# Altium project BeagleBone_Card.PrjPcb (part 1 of 4)
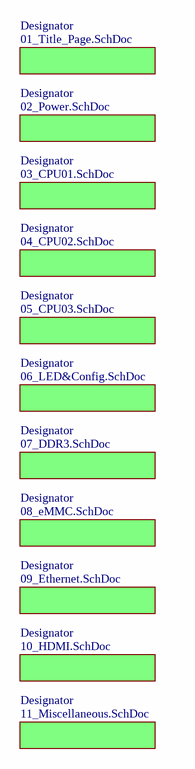
[diagram p0: BeagleBone_Card.SchDoc]
12 sheets, 376 parts. Net scope: flat (ports and power ports of the same name join across sheets).
Board file: BeagleBone_Card.PcbDoc
Sheets:
  BeagleBone_Card.SchDoc
    Designator = 02_Power.SchDoc
    Designator = 03_CPU01.SchDoc
    Designator = 04_CPU02.SchDoc
    Designator = 05_CPU03.SchDoc
    Designator = 06_LED&Config.SchDoc
    Designator = 07_DDR3.SchDoc
    Designator = 08_eMMC.SchDoc
    Designator = 09_Ethernet.SchDoc
    Designator = 10_HDMI.SchDoc
    Designator = 11_Miscellaneous.SchDoc
    Designator = 01_Title_Page.SchDoc

## Sheet BeagleBone_Card.SchDoc
size A4; Engineer: Mehmet Selcuk Yayan; Organization: Procenne

### Sub-sheets
Designator = 02_Power.SchDoc: no entries
Designator = 03_CPU01.SchDoc: no entries
Designator = 04_CPU02.SchDoc: no entries
Designator = 05_CPU03.SchDoc: no entries
Designator = 06_LED&Config.SchDoc: no entries
Designator = 07_DDR3.SchDoc: no entries
Designator = 08_eMMC.SchDoc: no entries
Designator = 09_Ethernet.SchDoc: no entries
Designator = 10_HDMI.SchDoc: no entries
Designator = 11_Miscellaneous.SchDoc: no entries
Designator = 01_Title_Page.SchDoc: no entries

### Notes on the sheet
- © 2020 Procenne Systems
- Title:
- Size:
- A4
- Number:
- Date:
- Rev:
- Sheet
- of

## Sheet 02_Power.SchDoc
size A4; Engineer: Mehmet Selcuk Yayan; Organization: Procenne
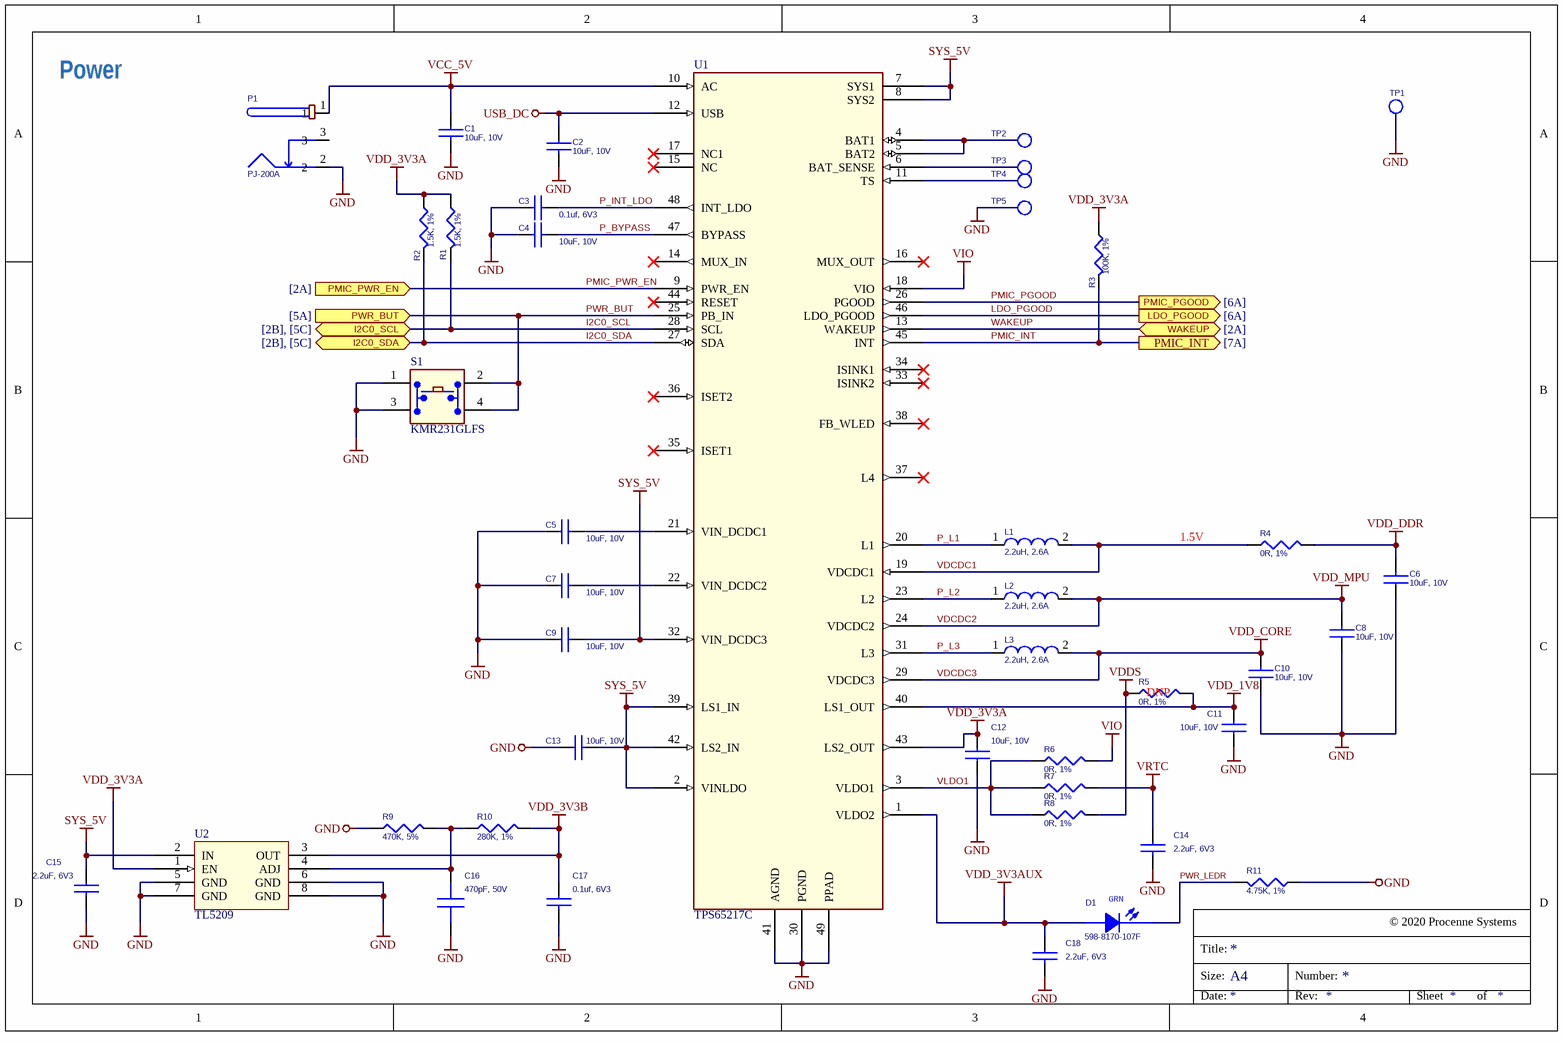
[diagram p1: 02_Power.SchDoc]

### Parts
C1  10uF, 10V  [805]
C2  10uF, 10V  [805]
C3  0.1uf, 6V3  [402]
C4  10uF, 10V  [805]
C5  10uF, 10V  [805]
C6  10uF, 10V  [805]
C7  10uF, 10V  [805]
C8  10uF, 10V  [805]
C9  10uF, 10V  [805]
C10  10uF, 10V  [805]
C11  10uF, 10V  [805]
C12  10uF, 10V  [805]
C13  10uF, 10V  [805]
C14  2.2uF, 6V3  [402]
C15  2.2uF, 6V3  [402]
C16  470pF, 50V  [402]
C17  0.1uf, 6V3  [402]
C18  2.2uF, 6V3  [402]
D1  598-8170-107F  [LED_0603]
L1  2.2uH, 2.6A  [2520]
L2  2.2uH, 2.6A  [2520]
L3  2.2uH, 2.6A  [2520]
P1  PJ-200A  [CONN3-PWR-PJ102A]
R1  1.5K, 1%  [402]
R2  1.5K, 1%  [402]
R3  100K, 1%  [402]
R4  0R, 1%  [402]
R5  0R, 1%  [402]
R6  0R, 1%  [402]
R7  0R, 1%  [402]
R8  0R, 1%  [402]
R9  470K, 5%  [402]
R10  280K, 1%  [402]
R11  4.75K, 1%  [402]
S1  KMR231GLFS  [SW4SMD_63X161LS]
TP1  TESTPT1  [tp1-8040]  (value not drawn)  (no BOM)
TP2  TESTPT1  [tp1-8040]  (value not drawn)  (no BOM)
TP3  TESTPT1  [tp1-8040]  (value not drawn)  (no BOM)
TP4  TESTPT1  [tp1-8040]  (value not drawn)  (no BOM)
TP5  TESTPT1  [tp1-8040]  (value not drawn)  (no BOM)
U1  TPS65217C  [U_48_RSL]
U2  TL5209  [SO8-25X75]

### Ports
I2C0_SCL (bidir, see [2B], [5C]), I2C0_SDA (bidir, see [2B], [5C]), LDO_PGOOD (out, see [6A]), PMIC_INT (out, see [7A]), PMIC_PGOOD (out, see [6A]), PMIC_PWR_EN (in, see [2A]), PWR_BUT (in, see [5A]), WAKEUP (bidir, see [2A])

### Nets
GND: C1.2 C2.2 C3.1 C4.1 C5.1 C6.1 C7.1 C8.1 C9.1 C10.1 C11.1 C12.1 C13.1 C14.2 C15.2 C16.2 C17.2 C18.2 P1.2 R9.1 R11.1 S1.1(A1) S1.3(A3) TP1.1(TP) TP5.1(TP) U1.30(PGND) U1.41(AGND) U1.49(PPAD) U2.5(GND) U2.6(GND) U2.7(GND) U2.8(GND)
SYS_5V: C9.2 C13.2 C15.1 U1.2(VINLDO) U1.7(SYS1) U1.8(SYS2) U1.32(VIN_DCDC3) U1.39(LS1_IN) U1.42(LS2_IN) U2.2(IN)
USB_DC: C2.1 U1.12(USB)
VCC_5V: C1.1 P1.1 U1.10(AC)
VDCDC2: C8.2 L2.2 U1.24(VDCDC2)  [also labelled VDD_MPU]
VDCDC3: C10.2 L3.2 U1.29(VDCDC3)  [also labelled VDD_CORE]
VDD_1V8: C11.2 R5.1(P1) U1.40(LS1_OUT)
VDD_3V3A: C12.2 R1.1 R2.1 R3.1 U1.43(LS2_OUT) U2.1(EN)
VDD_3V3AUX: C18.1 D1.2(A) U1.1(VLDO2)
VDD_3V3B: C17.1 R10.2 U2.3(OUT)
VDD_DDR: C6.2 R4.1(P1)
VDDS: R5.2(P2) R8.1(P1)
VIO: R6.1(P1) U1.18(VIO)
VRTC: C14.1 R7.1(P1)
I2C0_SCL: R1.2 U1.28(SCL) ; port I2C0_SCL
I2C0_SDA: R2.2 U1.27(SDA) ; port I2C0_SDA
LDO_PGOOD: U1.46(LDO_PGOOD) ; port LDO_PGOOD
P_BYPASS: C4.2 U1.47(BYPASS)
P_INT_LDO: C3.2 U1.48(INT_LDO)
P_L1: L1.1 U1.20(L1)
P_L2: L2.1 U1.23(L2)
P_L3: L3.1 U1.31(L3)
PMIC_INT: R3.2 U1.45(INT) ; port PMIC_INT
PMIC_PGOOD: U1.26(PGOOD) ; port PMIC_PGOOD
PMIC_PWR_EN: U1.9(PWR_EN) U1.13(WAKEUP) ; port PMIC_PWR_EN, port WAKEUP  [also labelled WAKEUP]  [project net PMIC_POWR_EN]
PWR_BUT: S1.2(A2) S1.4 U1.25(PB_IN) ; port PWR_BUT
PWR_LEDR: D1.1(C) R11.2
VDCDC1: L1.2 R4.2(P2) U1.19(VDCDC1)
VLDO1: R6.2(P2) R7.2(P2) R8.2(P2) U1.3(VLDO1)
NetC5_2: C5.2 U1.21(VIN_DCDC1)
NetC7_2: C7.2 U1.22(VIN_DCDC2)
NetC16_1: C16.1 R9.2 R10.1 U2.4(ADJ)
NetTP2_1: TP2.1(TP) U1.4(BAT1) U1.5(BAT2)
NetTP3_1: TP3.1(TP) U1.6(BAT_SENSE)
NetTP4_1: TP4.1(TP) U1.11(TS)

Not connected (* = marked no-connect by the designer): P1 3; U1 14(MUX_IN)* 15(NC)* 16(MUX_OUT)* 17(NC1)* 33(ISINK2)* 34(ISINK1)* 35(ISET1)* 36(ISET2)* 37(L4)* 38(FB_WLED)* 44(RESET)*

### Notes on the sheet
- Power
- 1.5V
- (near R5) DNP
- © 2020 Procenne Systems
- Title:
- Size:
- A4
- Number:
- Date:
- Rev:
- Sheet
- of
- (in symbol LED_LTST-C150GKT) GRN

### Library data of the parts
C1 C2 C4-C13 = CAP_10uF_Y5V_10V_10%_0805: CAP CER 10UF 10V Y5V 0805; Manufacturer: TDK Corporation; Manufacturer Part Number: C2012Y5V1A106Z; Capacitance: 10µF; Tolerance: -20%, +80%; Temperature Coefficient: Y5V (F); Supplier 1: Digi-Key; Supplier Part Number 1: 445-1371-6-ND; RoHS: RoHS Compliant; Category: Capacitors; Stock 1: 123307; Pricing 1: 1=0.15, 10=0.105, 100=0.0499, 250=0.042, 500=0.03518, 1000=0.02887 (USD); Voltage - Rated: 10V; Mounting Type: Surface Mount, MLCC; Operating Temperature: -30°C ~ 85°C; Applications: General Purpose; Ratings: -; Package / Case: 0805 (2012 Metric); Size / Dimension: 0.079" L x 0.049" W (2.00mm x 1.25mm); Height - Seated (Max): -; Thickness (Max): 0.057" (1.45mm); Lead Spacing: -; Features: -; Packaging: Digi-Reel®; Lead Style: -; ComponentLink1URL: http://media.digikey.com/pdf/Data%20Sheets/TDK%20PDFs/C_Series_GeneralAppl_B11.pdf; ComponentLink1Description: http://media.digikey.com/pdf/Data%20Sheets/TDK%20PDFs/C_Series_GeneralAppl_B11.pdf
C3 C17 = CAP_0.1uF_X7R_16V_10% 0402: CAP CER 0.1UF 6.3V 10% X5R 0402; Manufacturer: TDK Corporation; Manufacturer Part Number: C1005X5R0J104K050BA; Capacitance: 0.1µF; Applications: General Purpose; Category: Capacitors; ComponentLink1Description: http://www.kemet.com/datasheets&C0402C104K4RACTU; ComponentLink1URL: http://www.kemet.com/datasheets&C0402C104K4RACTU; Features: -; Height - Seated (Max): -; Lead Spacing: -; Lead Style: -; Mounting Type: Surface Mount, MLCC; Operating Temperature: -55°C ~ 85°C; Package / Case: 0402 (1005 Metric); Packaging: Digi-Reel®; Pricing 1: 1=0.1, 10=0.026, 100=0.0121, 250=0.00992, 500=0.00848, 1000=0.0066, 5000=0.0055 (USD); Ratings: -; RoHS: RoHS Compliant; Size / Dimension: 0.039" L x 0.020" W (1.00mm x 0.50mm); Stock 1: 127604; Supplier 1: Digi-Key; Supplier Part Number 1: 445-1266-6-ND; Temperature Coefficient: X5R; Thickness (Max): 0.022" (0.55mm); Tolerance: ±10%; Voltage - Rated: 6.3V
C14 C15 C18 = CAP_2.2uF_X5R_6.3V_10%_0402: CAP CER 2.2UF 6.3V 10% X5R 0402; Manufacturer: TDK Corporation; Manufacturer Part Number: C1005X5R0J225K050BC; Capacitance: 2.2µF; Supplier 1: Digi-Key; Supplier Part Number 1: 445-6847-6-ND; RoHS: RoHS Compliant; Category: Capacitors; Stock 1: 47221; Pricing 1: 1=0.24, 10=0.2, 100=0.1, 250=0.075, 500=0.06626, 1000=0.05875, 5000=0.04875 (USD); Voltage - Rated: 6.3V; Tolerance: ±10%; Temperature Coefficient: X5R; Mounting Type: Surface Mount, MLCC; Operating Temperature: -55°C ~ 85°C; Applications: General Purpose; Ratings: -; Package / Case: 0402 (1005 Metric); Size / Dimension: 0.039" L x 0.020" W (1.00mm x 0.50mm); Height - Seated (Max): -; Thickness (Max): 0.022" (0.55mm); Lead Spacing: -; Features: -; Packaging: Digi-Reel®; Lead Style: -; ComponentLink1URL: http://product.tdk.com/capacitor/mlcc/en/documents/mlcc_commercial_general_en.pdf; ComponentLink1Description: http://product.tdk.com/capacitor/mlcc/en/documents/mlcc_commercial_general_en.pdf
C16 = 470pF/5%/50V/C0G/0603_0: CAP CER 470PF 50V 10% X7R 0402; Manufacturer: Murata Electronics North America; Manufacturer Part Number: GRM155R71H471KA01D; Supplier 1: Digi-Key; Supplier Part Number 1: 490-1300-6-ND; RoHS: RoHS Compliant; Category: Capacitors; Stock 1: 211618; Pricing 1: 1=0.1, 10=0.025, 50=0.0136, 100=0.0116, 250=0.00944, 500=0.00808, 1000=0.0063, 5000=0.00525 (USD); Capacitance: 470pF; Voltage - Rated: 50V; Tolerance: ±10%; Temperature Coefficient: X7R; Mounting Type: Surface Mount, MLCC; Operating Temperature: -55°C ~ 125°C; Applications: General Purpose; Ratings: -; Package / Case: 0402 (1005 Metric); Size / Dimension: 0.039" L x 0.020" W (1.00mm x 0.50mm); Height - Seated (Max): -; Thickness (Max): 0.022" (0.55mm); Lead Spacing: -; Features: -; Packaging: Digi-Reel®; Lead Style: -; ComponentLink1URL: http://psearch.murata.com/capacitor/product/GRM155R71H471KA01#.pdf; ComponentLink1Description: http://psearch.murata.com/capacitor/product/GRM155R71H471KA01#.pdf
D1 = LED_LTST-C150GKT: LED GREEN CLEAR 0805 SMD; Manufacturer: Lite-On Inc; Manufacturer Part Number: LTST-C170KGKT; CLASS: DISCRETE; TN: 257-0020-000; Millicandela Rating: 35mcd; Voltage - Forward (Vf) Typ: 2V; Current - Test: 20mA; Wavelength - Dominant: 571nm; Wavelength - Peak: 574nm; Viewing Angle: 130°; Lens Style/Size: Rectangle with Flat Top, 1.4mm x 1.25mm; Supplier 1: Digi-Key; Supplier Part Number 1: 160-1414-6-ND; RoHS: RoHS Compliant; Category: Optoelectronics; Stock 1: 274890; Pricing 1: 1=0.37, 10=0.267, 100=0.1574, 250=0.11136, 500=0.09504, 1000=0.07425 (USD); Color: Green; Lens Type: Clear; Package / Case: 0805 (2012 Metric); Size / Dimension: 2.00mm L x 1.25mm W; Height: 1.10mm; Mounting Type: Surface Mount; Packaging: Digi-Reel®; Luminous Flux @ Current - Test: -; ComponentLink1URL: http://optoelectronics.liteon.com/en-us/api/DwonloadFileHandler.ashx?txtSpecNo=DS22-2000-073&txtPartNo=LTST-C170KGKT; ComponentLink1Description: http://optoelectronics.liteon.com/en-us/api/DwonloadFileHandler.ashx?txtSpecNo=DS22-2000-073&txtPartNo=LTST-C170KGKT
L1-L3 = IND_2.2uH_2.6A_10%_SMD_1: Inductor 2.2uH smt 2.6A, 58 milliohm; Manufacturer: Murata Electronics North America; Manufacturer Part Number: LQM2HPN2R2MG0L; Inductance: 2.2µH; Current Rating: 1.3A; Tolerance: ±20%; Shielding: Shielded; DC Resistance (DCR): 100 mOhm Max; Frequency - Self Resonant: 40MHz; Frequency - Test: 1MHz; Supplier 1: Digi-Key; Supplier Part Number 1: 490-5114-6-ND; RoHS: RoHS Compliant; Category: Inductors, Coils, Chokes; Stock 1: 4689; Pricing 1: 1=0.34, 10=0.307, 25=0.2728, 50=0.2388, 100=0.2217, 250=0.2046, 500=0.19438, 750=0.17732, 1000=0.15686 (USD); Type: -; Current - Saturation: -; Material - Core: -; Q @ Freq: -; Operating Temperature: -55°C ~ 125°C; Package / Case: 1008 (2520 Metric); Size / Dimension: 0.098" L x 0.079" W x 0.035" H (2.50mm x 2.00mm x 0.90mm); Mounting Type: Surface Mount; Packaging: Digi-Reel®; ComponentLink1URL: http://search.murata.co.jp/Ceramy/image/img/PDF/ENG/L0075S0104LQM2HP_G0.pdf; ComponentLink1Description: http://search.murata.co.jp/Ceramy/image/img/PDF/ENG/L0075S0104LQM2HP_G0.pdf
P1 = Power_Jack: CONN PWR JACK 2.1X5.5MM HIGH CUR; Manufacturer: CUI Inc; Manufacturer Part Number: PJ-002AH; Gender: Male; Plug/Mating Plug Diameter: 2.1mm ID, 5.5mm OD; Number of Positions/Contacts: 2 Conductors, 3 Contacts; Internal Switch(s): Single Switch, Normally Closed; Shielding: Unshielded; Current Rating: 5A; Supplier 1: Digi-Key; Supplier Part Number 1: CP-002AH-ND; RoHS: RoHS Compliant; Category: Connectors, Interconnects; Stock 1: 81962; Pricing 1: 1=1.01, 10=0.704, 100=0.4724, 500=0.3819, 1000=0.3417, 2500=0.27135 (USD); Connector Type: Jack; Mounting Type: Through Hole, Right Angle; Termination: Solder Eyelet(s); Features: -; Color: Black; Contact Material: Copper Alloy; Contact Material - Plating: Nickel; Housing Color: Black; Housing Material: Thermoplastic; Operating Temperature: -25°C ~ 85°C; ComponentLink1URL: http://www.cui.com/Product/Resource/DigiKeyPDF/PJ-002AH.pdf; ComponentLink1Description: http://www.cui.com/Product/Resource/DigiKeyPDF/PJ-002AH.pdf
R1 R2 = RES_1.5K_1/16W_5%_0402: RES 1.50K OHM 1/16W 1% 0402 SMD; Manufacturer: Yageo; Manufacturer Part Number: RC0402FR-071K5L; Power (Watts): 0.063W, 1/16W; Temperature Coefficient: ±100ppm/°C; Supplier 1: Digi-Key; Supplier Part Number 1: 311-1.50KLRDKR-ND; RoHS: RoHS Compliant; Category: Resistors; Stock 1: 465266; Pricing 1: 1=0.1, 10=0.014, 25=0.0104, 100=0.0063, 250=0.0054, 500=0.00382, 1000=0.0027, 2500=0.00234, 5000=0.00203 (USD); Resistance (Ohms): 1.5k; Composition: Thick Film; Features: -; Tolerance: ±1%; Package / Case: 0402 (1005 Metric); Supplier Device Package: 0402; Size / Dimension: 0.039" L x 0.020" W (1.00mm x 0.50mm); Height: 0.016" (0.40mm); Number of Terminations: 2; Packaging: Digi-Reel®; ComponentLink1URL: http://www.yageo.com/documents/recent/PYu-RC0402_51_RoHS_L_6.pdf; ComponentLink1Description: http://www.yageo.com/documents/recent/PYu-RC0402_51_RoHS_L_6.pdf
R3 = RES_100K_1/16W_1%_0402: RES 100K OHM 1/16W 1% 0402 SMD; Manufacturer: Stackpole Electronics Inc; Manufacturer Part Number: RMCF0402FT100K; Power (Watts): 0.063W, 1/16W; Temperature Coefficient: ±100ppm/°C; Category: Resistors; ComponentLink1Description: http://www.seielect.com/Catalog/SEI-RMCF_RMCP.pdf; ComponentLink1URL: http://www.seielect.com/Catalog/SEI-RMCF_RMCP.pdf; Composition: Thick Film; Features: -; Height: 0.016" (0.40mm); Number of Terminations: 2; Package / Case: 0402 (1005 Metric); Packaging: Digi-Reel®; Pricing 1: 1=0.04, 10=0.025, 50=0.0138, 100=0.0105, 250=0.0078, 500=0.00576, 1000=0.00384, 2500=0.00324, 5000=0.0027 (USD); Resistance (Ohms): 100k; RoHS: RoHS Compliant; Size / Dimension: 0.039" L x 0.020" W (1.00mm x 0.50mm); Stock 1: 851196; Supplier 1: Digi-Key; Supplier Device Package: 0402; Supplier Part Number 1: RMCF0402FT100KDKR-ND; Tolerance: ±1%
R4-R8 = RES SMD_2: RES 0.0 OHM 1/16W 0402 SMD; Manufacturer: Yageo; Manufacturer Part Number: RC0402JR-070RL; Resistance (Ohms): 0.0; Power (Watts): 0.063W, 1/16W; Tolerance: Jumper; Supplier 1: Digi-Key; Supplier Part Number 1: 311-0.0JRDKR-ND; RoHS: RoHS Compliant; Category: Resistors; Stock 1: 4565215; Pricing 1: 1=0.1, 10=0.012, 25=0.0092, 100=0.0055, 250=0.00476, 500=0.00336, 1000=0.00237, 2500=0.00206, 5000=0.00178 (USD); Composition: Thick Film; Features: -; Temperature Coefficient: -; Package / Case: 0402 (1005 Metric); Supplier Device Package: 0402; Size / Dimension: 0.039" L x 0.020" W (1.00mm x 0.50mm); Height: 0.016" (0.40mm); Number of Terminations: 2; Packaging: Digi-Reel®; ComponentLink1URL: http://www.yageo.com/documents/recent/PYu-RC0402_51_RoHS_L_6.pdf; ComponentLink1Description: http://www.yageo.com/documents/recent/PYu-RC0402_51_RoHS_L_6.pdf
R9 = RES_470_1/10W_5%_0402_1: RES 470K OHM 1/16W 1% 0402 SMD; Manufacturer: Yageo; Manufacturer Part Number: RC0402FR-07470KL; Power (Watts): 0.063W, 1/16W; Temperature Coefficient: ±100ppm/°C; Supplier 1: Digi-Key; Supplier Part Number 1: 311-470KLRDKR-ND; RoHS: RoHS Compliant; Category: Resistors; Stock 1: 133693; Pricing 1: 1=0.1, 10=0.014, 25=0.0104, 100=0.0063, 250=0.0054, 500=0.00382, 1000=0.0027, 2500=0.00234, 5000=0.00203 (USD); Resistance (Ohms): 470k; Composition: Thick Film; Features: -; Tolerance: ±1%; Package / Case: 0402 (1005 Metric); Supplier Device Package: 0402; Size / Dimension: 0.039" L x 0.020" W (1.00mm x 0.50mm); Height: 0.016" (0.40mm); Number of Terminations: 2; Packaging: Digi-Reel®; ComponentLink1URL: http://www.yageo.com/documents/recent/PYu-RC0402_51_RoHS_L_6.pdf; ComponentLink1Description: http://www.yageo.com/documents/recent/PYu-RC0402_51_RoHS_L_6.pdf
R10 = RES_470_1/10W_5%_0402_2: RES 280K OHM 1/16W 1% 0402 SMD; Manufacturer: Stackpole Electronics Inc; Manufacturer Part Number: RMCF0402FT280K; Power (Watts): 0.063W, 1/16W; Temperature Coefficient: ±100ppm/°C; Supplier 1: Digi-Key; Supplier Part Number 1: RMCF0402FT280KDKR-ND; RoHS: RoHS Compliant; Category: Resistors; Stock 1: 31693; Pricing 1: 1=0.04, 10=0.025, 50=0.0138, 100=0.0105, 250=0.0078, 500=0.00576, 1000=0.00384, 2500=0.00324, 5000=0.0027 (USD); Resistance (Ohms): 280k; Composition: Thick Film; Features: -; Tolerance: ±1%; Package / Case: 0402 (1005 Metric); Supplier Device Package: 0402; Size / Dimension: 0.039" L x 0.020" W (1.00mm x 0.50mm); Height: 0.016" (0.40mm); Number of Terminations: 2; Packaging: Digi-Reel®; ComponentLink1URL: http://www.seielect.com/Catalog/SEI-RMCF_RMCP.pdf; ComponentLink1Description: http://www.seielect.com/Catalog/SEI-RMCF_RMCP.pdf
R11 = RES_4.75K_1/16W_1%_0402: RES 4.75K OHM 1/16W 1% 0402 SMD; Manufacturer: Stackpole Electronics Inc; Manufacturer Part Number: RMCF0402FT4K75; Power (Watts): 0.063W, 1/16W; Temperature Coefficient: ±100ppm/°C; Supplier 1: Digi-Key; Supplier Part Number 1: RMCF0402FT4K75DKR-ND; RoHS: RoHS Compliant; Category: Resistors; Stock 1: 280917; Pricing 1: 1=0.04, 10=0.025, 50=0.0138, 100=0.0105, 250=0.0078, 500=0.00576, 1000=0.00384, 2500=0.00324, 5000=0.0027 (USD); Resistance (Ohms): 4.75k; Composition: Thick Film; Features: -; Tolerance: ±1%; Package / Case: 0402 (1005 Metric); Supplier Device Package: 0402; Size / Dimension: 0.039" L x 0.020" W (1.00mm x 0.50mm); Height: 0.016" (0.40mm); Number of Terminations: 2; Packaging: Digi-Reel®; ComponentLink1URL: http://www.seielect.com/Catalog/SEI-RMCF_RMCP.pdf; ComponentLink1Description: http://www.seielect.com/Catalog/SEI-RMCF_RMCP.pdf
S1 = KMR2: Microminiature Tact Switch for SMT; Manufacturer: C&K Components; Circuit: SPST-NO; Switch Function: Off-Mom; Contact Rating @ Voltage: 0.05A @ 32VDC; Actuator Type: Standard; Actuator Height off PCB, from Pins: 1.90mm; Actuator Orientation: Top Actuated; Outline: 4.60mm x 2.80mm; Illumination: Non-Illuminated; Operating Force: 300gf; Switch Travel: 0.25mm; Mechanical Life: 150,000 Cycles; Supplier 1: Digi-Key; Supplier Part Number 1: 401-1429-6-ND; Manufacturer Part Number: KMR231GLFS; RoHS: RoHS Compliant; Category: Switches; Stock 1: 32289; Pricing 1: 1=0.44, 10=0.416, 25=0.3744, 50=0.3326, 100=0.3188, 250=0.29108, 500=0.2772, 1000=0.22869 (USD); Mounting Type: Surface Mount; Termination Style: Gull Wing; Illumination Voltage (Nominal): -; Illumination Type, Color: -; Ingress Protection: -; Features: Grounding Pin; Packaging: Digi-Reel®; Actuator Material: -; Operating Temperature: -40°C ~ 85°C; ComponentLink1URL: http://www.ck-components.com/index.php?module=media&action=Display&cmpref=14414&lang=en&width=&height=&format=&alt=; ComponentLink1Description: http://www.ck-components.com/index.php?module=media&action=Display&cmpref=14414&lang=en&width=&height=&format=&alt=
U1 = PWR_TPS65217_2: IC PMIC BATT PWR SYST 48VQFN; Manufacturer: Texas Instruments; Manufacturer Part Number: TPS65217CRSLR; Voltage - Supply: 2.75 V ~ 5.8 V; Supplier 1: Digi-Key; Supplier Part Number 1: 296-34814-6-ND; RoHS: RoHS Compliant; Category: Integrated Circuits (ICs); Stock 1: 0; Pricing 1: 1=8.01, 10=7.204, 25=6.5516, 100=4.1918, 250=4.11412, 500=4.0365, 750=3.95888 (USD); Applications: Battery Management, Display (LED Drivers), Handheld/Mobile Devices, Power Supply; Current - Supply: -; Operating Temperature: -40°C ~ 105°C; Mounting Type: Surface Mount; Package / Case: 48-VFQFN Exposed Pad; Supplier Device Package: 48-VQFN-EP (6x6); Packaging: Digi-Reel®; ComponentLink1URL: http://www.ti.com/lit/ds/symlink/tps65217c.pdf; ComponentLink1Description: http://www.ti.com/lit/ds/symlink/tps65217c.pdf
U2 = TL5209: IC LDO VOLT REG 500MA 8-SOIC; Manufacturer: Texas Instruments; Manufacturer Part Number: TL5209DR; Regulator Topology: Positive Adjustable; Voltage - Output: 2.5 V ~ 6.5 V; Voltage - Input: 2.5 V ~ 16 V; Voltage - Dropout (Typical): 0.35V @ 500mA; Number of Regulators: 1; Current - Output: 500mA (Max); Supplier 1: Digi-Key; Supplier Part Number 1: 296-21569-6-ND; RoHS: RoHS Compliant; Category: Integrated Circuits (ICs); Stock 1: 7190; Pricing 1: 1=1.41, 10=1.244, 25=1.1232, 100=0.9828, 250=0.86192, 500=0.7644, 1000=0.6045 (USD); Current - Limit (Min): -; Operating Temperature: -40°C ~ 125°C; Mounting Type: Surface Mount; Package / Case: 8-SOIC (0.154", 3.90mm Width); Supplier Device Package: 8-SOIC; Packaging: Digi-Reel®; ComponentLink1URL: http://media.digikey.com/pdf/Data%20Sheets/Texas%20Instruments%20PDFs/TL5209.pdf; ComponentLink1Description: http://media.digikey.com/pdf/Data%20Sheets/Texas%20Instruments%20PDFs/TL5209.pdf

## Sheet 03_CPU01.SchDoc
size A3; Engineer: Mehmet Selcuk Yayan; Organization: Procenne
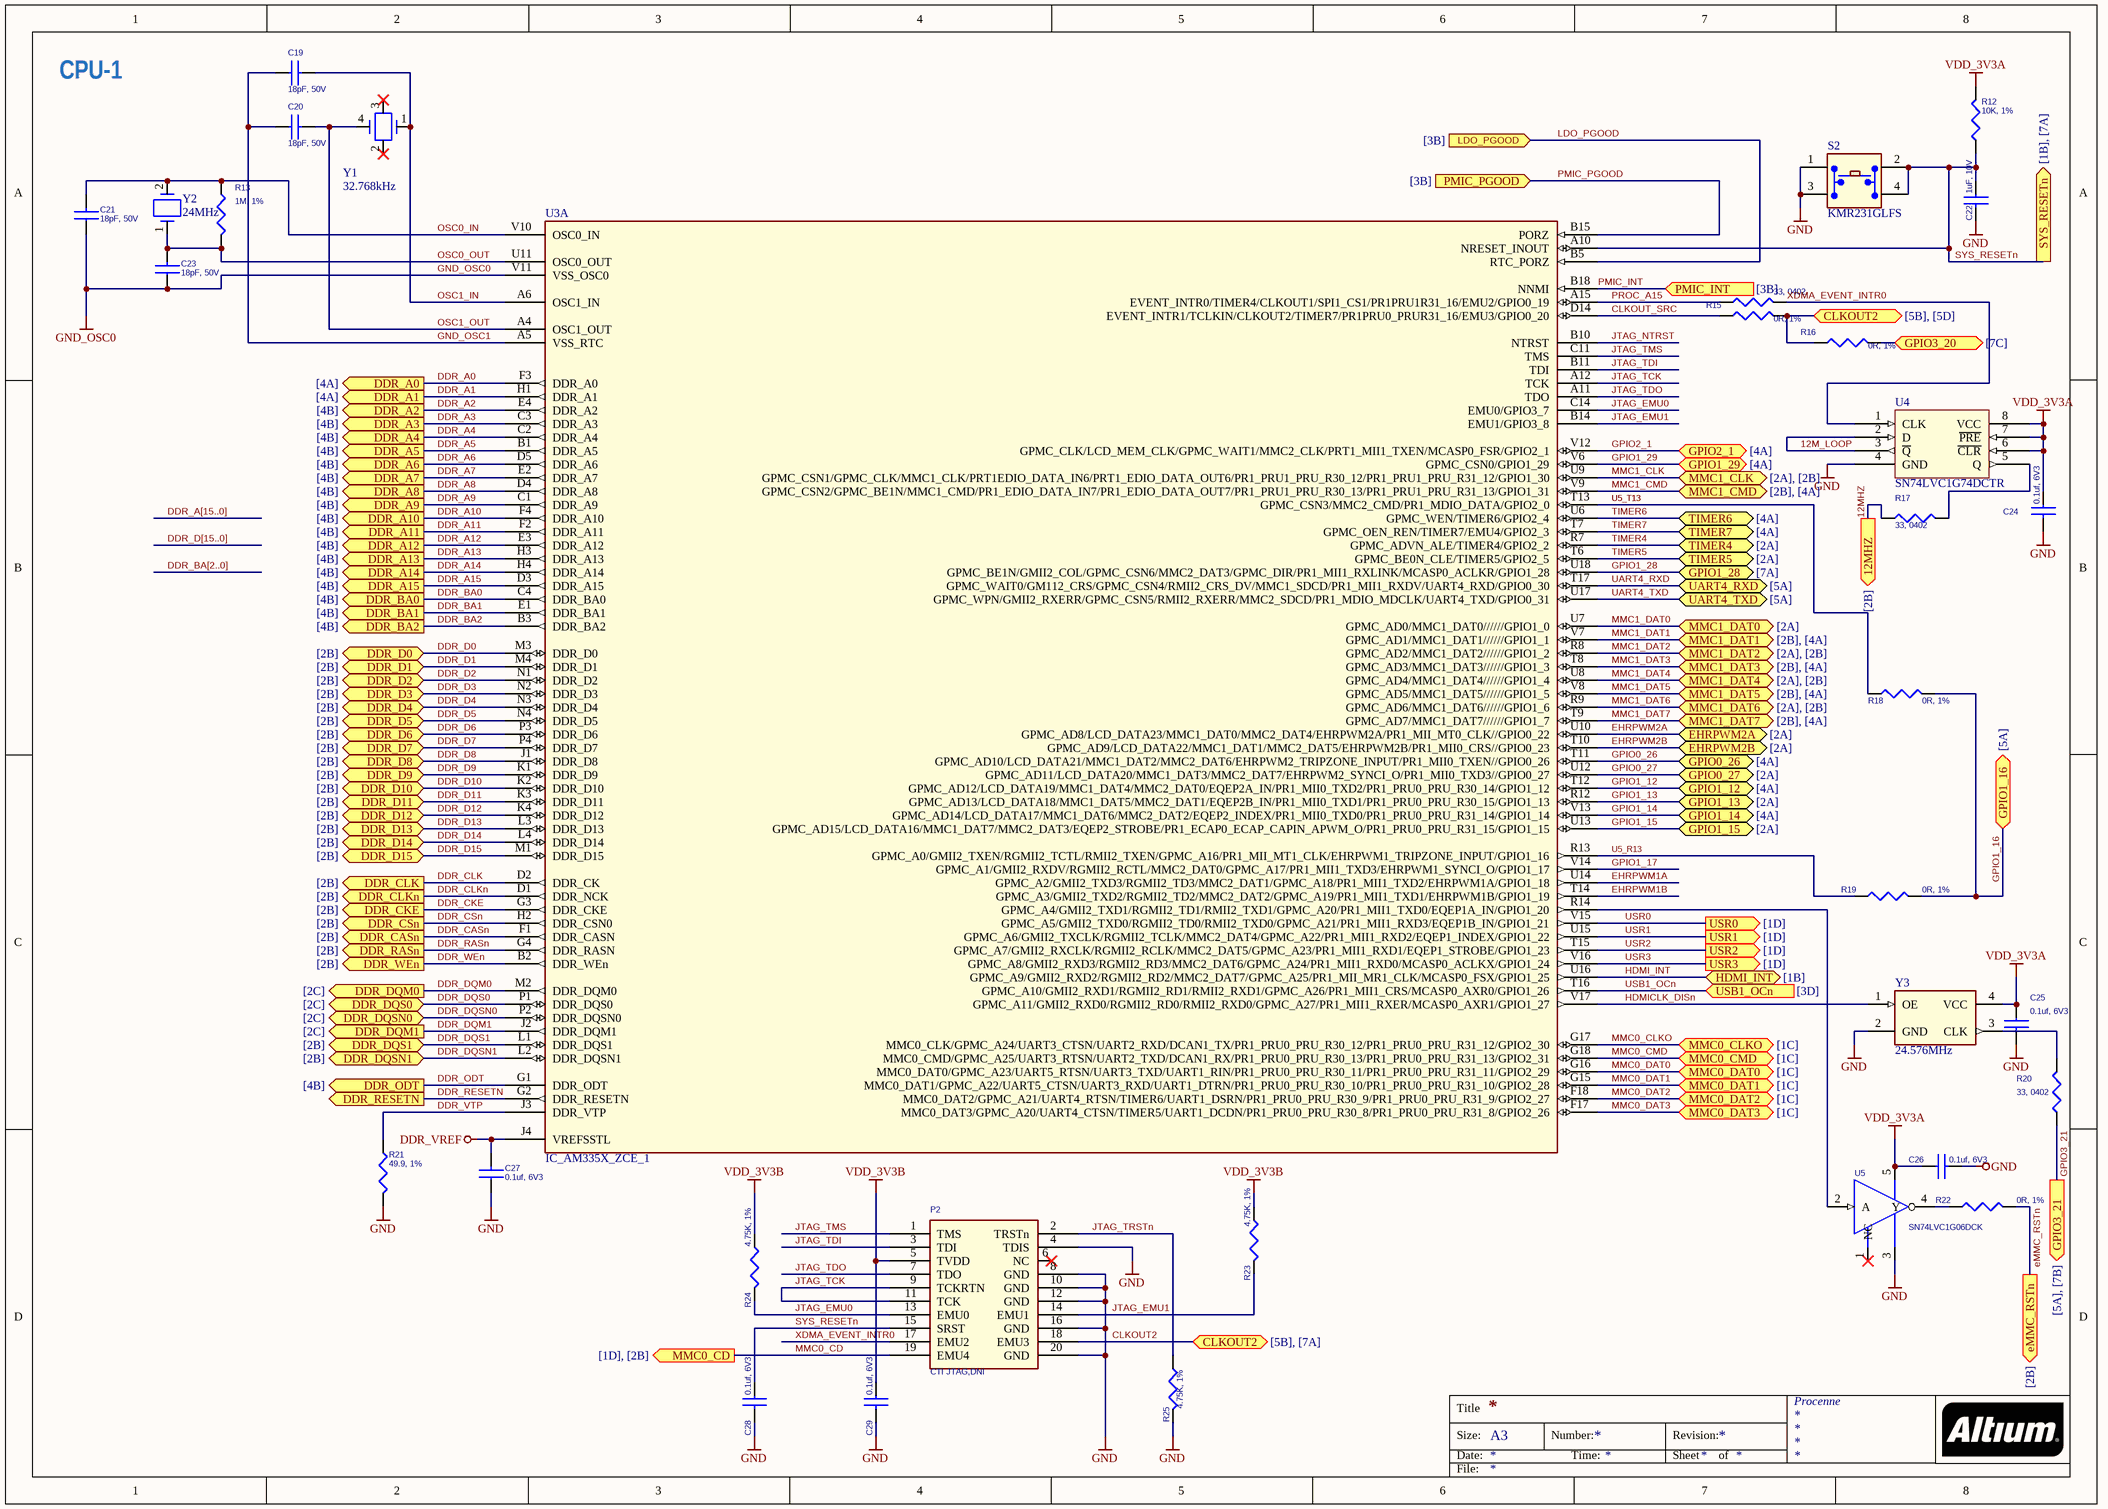
[diagram p2: 03_CPU01.SchDoc]

### Parts
C19  18pF, 50V  [402]
C20  18pF, 50V  [402]
C21  18pF, 50V  [402]
C22  1uF, 10V  [402]
C23  18pF, 50V  [402]
C24  0.1uf, 6V3  [402]
C25  0.1uf, 6V3  [402]
C26  0.1uf, 6V3  [402]
C27  0.1uf, 6V3  [402]
C28  0.1uf, 6V3  [402]
C29  0.1uf, 6V3  [402]
P2  CTI JTAG,DNI  [HEADER10X2_SMD]
R12  10K, 1%  [402]
R13  1M, 1%  [402]
R14  33, 0402  [402]
R15  0R, 1%  [402]
R16  0R, 1%  [402]
R17  33, 0402  [402]
R18  0R, 1%  [402]
R19  0R, 1%  [402]
R20  33, 0402  [402]
R21  49.9, 1%  [402]
R22  0R, 1%  [402]
R23  4.75K, 1%  [402]
R24  4.75K, 1%  [402]
R25  4.75K, 1%  [402]
S2  KMR231GLFS  [SW4SMD_63X161LS]
U3  IC_AM335X_ZCE_1  [am33xx_15x15]  (part A of 3)
U4  SN74LVC1G74DCTR  [SOP8_DCT]
U5  SN74LVC1G06DCK  [DCK5_2P15X1P4]
Y1  32.768kHz  [XTAL4_126-216SMD]
Y2  24MHz  [XTAL150SMD_125X196]
Y3  24.576MHz  [OSC4_61X65LS_79X98SMD]

### Ports
12MHZ (out, see [2B]), CLKOUT2 (bidir, see [5B], [5D]), CLKOUT2 (bidir, see [5B], [7A]), DDR_A0 (out, see [4A]), DDR_A1 (out, see [4A]), DDR_A2 (out, see [4B]), DDR_A3 (out, see [4B]), DDR_A4 (out, see [4B]), DDR_A5 (out, see [4B]), DDR_A6 (out, see [4B]), DDR_A7 (out, see [4B]), DDR_A8 (out, see [4B]), DDR_A9 (out, see [4B]), DDR_A10 (out, see [4B]), DDR_A11 (out, see [4B]), DDR_A12 (out, see [4B]), DDR_A13 (out, see [4B]), DDR_A14 (out, see [4B]), DDR_A15 (out, see [4B]), DDR_BA0 (out, see [4B]), DDR_BA1 (out, see [4B]), DDR_BA2 (out, see [4B]), DDR_CASn (out, see [2B]), DDR_CKE (out, see [2B]), DDR_CLK (out, see [2B]), DDR_CLKn (out, see [2B]), DDR_CSn (out, see [2B]), DDR_D0 (bidir, see [2B]), DDR_D1 (bidir, see [2B]), DDR_D2 (bidir, see [2B]), DDR_D3 (bidir, see [2B]), DDR_D4 (bidir, see [2B]), DDR_D5 (bidir, see [2B]), DDR_D6 (bidir, see [2B]), DDR_D7 (bidir, see [2B]), DDR_D8 (bidir, see [2B]), DDR_D9 (bidir, see [2B]), DDR_D10 (bidir, see [2B]), DDR_D11 (bidir, see [2B]), DDR_D12 (bidir, see [2B]), DDR_D13 (bidir, see [2B]), DDR_D14 (bidir, see [2B]), DDR_D15 (bidir, see [2B]), DDR_DQM0 (out, see [2C]), DDR_DQM1 (out, see [2C]), DDR_DQS0 (bidir, see [2C]), DDR_DQS1 (bidir, see [2B]), DDR_DQSN0 (bidir, see [2C]), DDR_DQSN1 (bidir, see [2B]), DDR_ODT (out, see [4B]), DDR_RASn (out, see [2B]), DDR_RESETN (out), DDR_WEn (out, see [2B]), EHRPWM2A (bidir, see [2A]), EHRPWM2B (bidir, see [2A]), eMMC_RSTn (out, see [2B]), GPIO0_26 (bidir, see [4A]), GPIO0_27 (bidir, see [2A]), GPIO1_12 (bidir, see [4A]), GPIO1_13 (bidir, see [2A]), GPIO1_14 (bidir, see [4A]), GPIO1_15 (bidir, see [2A]), GPIO1_16 (bidir, see [5A]), GPIO1_28 (bidir, see [7A]), GPIO1_29 (bidir, see [4A]), GPIO2_1 (bidir, see [4A]), GPIO3_20 (bidir, see [7C]), GPIO3_21 (out, see [5A], [7B]), HDMI_INT (bidir, see [1B]), LDO_PGOOD (in, see [3B]), MMC0_CD (out, see [1D], [2B]), MMC0_CLKO (bidir, see [1C]), MMC0_CMD (bidir, see [1C]), MMC0_DAT0 (bidir, see [1C]), MMC0_DAT1 (bidir, see [1C]), MMC0_DAT2 (bidir, see [1C]), MMC0_DAT3 (bidir, see [1C]), MMC1_CLK (bidir, see [2A], [2B]), MMC1_CMD (bidir, see [2B], [4A]), MMC1_DAT0 (bidir, see [2A]), MMC1_DAT1 (bidir, see [2B], [4A]), MMC1_DAT2 (bidir, see [2A], [2B]), MMC1_DAT3 (bidir, see [2B], [4A]), MMC1_DAT4 (bidir, see [2A], [2B]), MMC1_DAT5 (bidir, see [2B], [4A]), MMC1_DAT6 (bidir, see [2A], [2B]), MMC1_DAT7 (bidir, see [2B], [4A]), PMIC_INT (in, see [3B]), PMIC_PGOOD (in, see [3B]), SYS_RESETn (out, see [1B], [7A]), TIMER4 (bidir, see [2A]), TIMER5 (bidir, see [2A]), TIMER6 (bidir, see [4A]), TIMER7 (bidir, see [4A]), UART4_RXD (bidir, see [5A]), UART4_TXD (bidir, see [5A]), USB1_OCn (in, see [3D]), USR0 (out, see [1D]), USR1 (out, see [1D]), USR2 (out, see [1D]), USR3 (out, see [1D])

### Nets
DDR_VREF: C27.2 U3.J4(VREFSSTL)
GND: C22.2 C24.2 C25.2 C26.2 C27.1 C28.2 C29.2 P2.4(TDIS) P2.8(GND) P2.10(GND) P2.12(GND) P2.16(GND) P2.20(GND) R21.2 R25.2 S2.1(A1) S2.3(A3) U4.4(GND) U5.3(GND) Y3.2(GND)
GND_OSC0: C21.1 C23.1 U3.V11(VSS_OSC0)
VDD_3V3A: C24.1 C25.1 C26.1 R12.2 U4.6(~{CLR}) U4.7(~{PRE}) U4.8(VCC) U5.5(VCC) Y3.4(VCC)
VDD_3V3B: C29.1 P2.5(TVDD) R23.1 R24.1
12M_LOOP: U4.2(D) U4.3(~{Q})
12MHZ: R17.1 ; port 12MHZ
CLKOUT2: P2.18(EMU3) R15.2 R16.1 ; port CLKOUT2
CLKOUT_SRC: R15.1 U3.D14(EVENT_INTR1/TCLKIN/CLKOUT2/TIMER7/PR1PRU0_PRUR31_16/EMU3/GPIO0_20)
DDR_A0: U3.F3(DDR_A0) ; port DDR_A0
DDR_A1: U3.H1(DDR_A1) ; port DDR_A1
DDR_A2: U3.E4(DDR_A2) ; port DDR_A2
DDR_A3: U3.C3(DDR_A3) ; port DDR_A3
DDR_A4: U3.C2(DDR_A4) ; port DDR_A4
DDR_A5: U3.B1(DDR_A5) ; port DDR_A5
DDR_A6: U3.D5(DDR_A6) ; port DDR_A6
DDR_A7: U3.E2(DDR_A7) ; port DDR_A7
DDR_A8: U3.D4(DDR_A8) ; port DDR_A8
DDR_A9: U3.C1(DDR_A9) ; port DDR_A9
DDR_A10: U3.F4(DDR_A10) ; port DDR_A10
DDR_A11: U3.F2(DDR_A11) ; port DDR_A11
DDR_A12: U3.E3(DDR_A12) ; port DDR_A12
DDR_A13: U3.H3(DDR_A13) ; port DDR_A13
DDR_A14: U3.H4(DDR_A14) ; port DDR_A14
DDR_A15: U3.D3(DDR_A15) ; port DDR_A15
DDR_BA0: U3.C4(DDR_BA0) ; port DDR_BA0
DDR_BA1: U3.E1(DDR_BA1) ; port DDR_BA1
DDR_BA2: U3.B3(DDR_BA2) ; port DDR_BA2
DDR_CASn: U3.F1(DDR_CASN) ; port DDR_CASn
DDR_CKE: U3.G3(DDR_CKE) ; port DDR_CKE
DDR_CLK: U3.D2(DDR_CK) ; port DDR_CLK
DDR_CLKn: U3.D1(DDR_NCK) ; port DDR_CLKn
DDR_CSn: U3.H2(DDR_CSN0) ; port DDR_CSn
DDR_D0: U3.M3(DDR_D0) ; port DDR_D0
DDR_D1: U3.M4(DDR_D1) ; port DDR_D1
DDR_D2: U3.N1(DDR_D2) ; port DDR_D2
DDR_D3: U3.N2(DDR_D3) ; port DDR_D3
DDR_D4: U3.N3(DDR_D4) ; port DDR_D4
DDR_D5: U3.N4(DDR_D5) ; port DDR_D5
DDR_D6: U3.P3(DDR_D6) ; port DDR_D6
DDR_D7: U3.P4(DDR_D7) ; port DDR_D7
DDR_D8: U3.J1(DDR_D8) ; port DDR_D8
DDR_D9: U3.K1(DDR_D9) ; port DDR_D9
DDR_D10: U3.K2(DDR_D10) ; port DDR_D10
DDR_D11: U3.K3(DDR_D11) ; port DDR_D11
DDR_D12: U3.K4(DDR_D12) ; port DDR_D12
DDR_D13: U3.L3(DDR_D13) ; port DDR_D13
DDR_D14: U3.L4(DDR_D14) ; port DDR_D14
DDR_D15: U3.M1(DDR_D15) ; port DDR_D15
DDR_DQM0: U3.M2(DDR_DQM0) ; port DDR_DQM0
DDR_DQM1: U3.J2(DDR_DQM1) ; port DDR_DQM1
DDR_DQS0: U3.P1(DDR_DQS0) ; port DDR_DQS0
DDR_DQS1: U3.L1(DDR_DQS1) ; port DDR_DQS1
DDR_DQSN0: U3.P2(DDR_DQSN0) ; port DDR_DQSN0
DDR_DQSN1: U3.L2(DDR_DQSN1) ; port DDR_DQSN1
DDR_ODT: U3.G1(DDR_ODT) ; port DDR_ODT
DDR_RASn: U3.G4(DDR_RASN) ; port DDR_RASn
DDR_RESETN: U3.G2(DDR_RESETN) ; port DDR_RESETN
DDR_VTP: R21.1 U3.J3(DDR_VTP)
DDR_WEn: U3.B2(DDR_WEn) ; port DDR_WEn
EHRPWM1A: U3.U14(GPMC_A2/GMII2_TXD3/RGMII2_TD3/MMC2_DAT1/GPMC_A18/PR1_MII1_TXD2/EHRPWM1A/GPIO1_18)
EHRPWM1B: U3.T14(GPMC_A3/GMII2_TXD2/RGMII2_TD2/MMC2_DAT2/GPMC_A19/PR1_MII1_TXD1/EHRPWM1B/GPIO1_19)
EHRPWM2A: U3.U10(GPMC_AD8/LCD_DATA23/MMC1_DAT0/MMC2_DAT4/EHRPWM2A/PR1_MII_MT0_CLK//GPIO0_22) ; port EHRPWM2A
EHRPWM2B: U3.T10(GPMC_AD9/LCD_DATA22/MMC1_DAT1/MMC2_DAT5/EHRPWM2B/PR1_MII0_CRS//GPIO0_23) ; port EHRPWM2B
eMMC_RSTn: R22.2 ; port eMMC_RSTn
GND_OSC1: C19.1 C20.1 U3.A5(VSS_RTC)
GPIO0_26: U3.T11(GPMC_AD10/LCD_DATA21/MMC1_DAT2/MMC2_DAT6/EHRPWM2_TRIPZONE_INPUT/PR1_MII0_TXEN//GPIO0_26) ; port GPIO0_26
GPIO0_27: U3.U12(GPMC_AD11/LCD_DATA20/MMC1_DAT3/MMC2_DAT7/EHRPWM2_SYNCI_O/PR1_MII0_TXD3//GPIO0_27) ; port GPIO0_27
GPIO1_12: U3.T12(GPMC_AD12/LCD_DATA19/MMC1_DAT4/MMC2_DAT0/EQEP2A_IN/PR1_MII0_TXD2/PR1_PRU0_PRU_R30_14/GPIO1_12) ; port GPIO1_12
GPIO1_13: U3.R12(GPMC_AD13/LCD_DATA18/MMC1_DAT5/MMC2_DAT1/EQEP2B_IN/PR1_MII0_TXD1/PR1_PRU0_PRU_R30_15/GPIO1_13) ; port GPIO1_13
GPIO1_14: U3.V13(GPMC_AD14/LCD_DATA17/MMC1_DAT6/MMC2_DAT2/EQEP2_INDEX/PR1_MII0_TXD0/PR1_PRU0_PRU_R31_14/GPIO1_14) ; port GPIO1_14
GPIO1_15: U3.U13(GPMC_AD15/LCD_DATA16/MMC1_DAT7/MMC2_DAT3/EQEP2_STROBE/PR1_ECAP0_ECAP_CAPIN_APWM_O/PR1_PRU0_PRU_R31_15/GPIO1_15) ; port GPIO1_15
GPIO1_16: R18.2 R19.2 ; port GPIO1_16
GPIO1_17: U3.V14(GPMC_A1/GMII2_RXDV/RGMII2_RCTL/MMC2_DAT0/GPMC_A17/PR1_MII1_TXD3/EHRPWM1_SYNCI_O/GPIO1_17)
GPIO1_28: U3.U18(GPMC_BE1N/GMII2_COL/GPMC_CSN6/MMC2_DAT3/GPMC_DIR/PR1_MII1_RXLINK/MCASP0_ACLKR/GPIO1_28) ; port GPIO1_28
GPIO1_29: U3.V6(GPMC_CSN0/GPIO1_29) ; port GPIO1_29
GPIO2_1: U3.V12(GPMC_CLK/LCD_MEM_CLK/GPMC_WAIT1/MMC2_CLK/PRT1_MII1_TXEN/MCASP0_FSR/GPIO2_1) ; port GPIO2_1
GPIO3_21: R20.1 ; port GPIO3_21
HDMI_INT: U3.U16(GPMC_A9/GMII2_RXD2/RGMII2_RD2/MMC2_DAT7/GPMC_A25/PR1_MII_MR1_CLK/MCASP0_FSX/GPIO1_25) ; port HDMI_INT
HDMICLK_DISn: U3.V17(GPMC_A11/GMII2_RXD0/RGMII2_RD0/RMII2_RXD0/GPMC_A27/PR1_MII1_RXER/MCASP0_AXR1/GPIO1_27) Y3.1(OE)
JTAG_EMU0: P2.13(EMU0) R24.2 U3.C14(EMU0/GPIO3_7)
JTAG_EMU1: P2.14(EMU1) R23.2 U3.B14(EMU1/GPIO3_8)
JTAG_NTRST: U3.B10(NTRST)
JTAG_TCK: P2.9(TCKRTN) P2.11(TCK) U3.A12(TCK)
JTAG_TDI: P2.3(TDI) U3.B11(TDI)
JTAG_TDO: P2.7(TDO) U3.A11(TDO)
JTAG_TMS: P2.1(TMS) U3.C11(TMS)
JTAG_TRSTn: P2.2(TRSTn) R25.1
LDO_PGOOD: U3.B5(RTC_PORZ) ; port LDO_PGOOD
MMC0_CD: P2.19(EMU4) ; port MMC0_CD
MMC0_CLKO: U3.G17(MMC0_CLK/GPMC_A24/UART3_CTSN/UART2_RXD/DCAN1_TX/PR1_PRU0_PRU_R30_12/PR1_PRU0_PRU_R31_12/GPIO2_30) ; port MMC0_CLKO
MMC0_CMD: U3.G18(MMC0_CMD/GPMC_A25/UART3_RTSN/UART2_TXD/DCAN1_RX/PR1_PRU0_PRU_R30_13/PR1_PRU0_PRU_R31_13/GPIO2_31) ; port MMC0_CMD
MMC0_DAT0: U3.G16(MMC0_DAT0/GPMC_A23/UART5_RTSN/UART3_TXD/UART1_RIN/PR1_PRU0_PRU_R30_11/PR1_PRU0_PRU_R31_11/GPIO2_29) ; port MMC0_DAT0
MMC0_DAT1: U3.G15(MMC0_DAT1/GPMC_A22/UART5_CTSN/UART3_RXD/UART1_DTRN/PR1_PRU0_PRU_R30_10/PR1_PRU0_PRU_R31_10/GPIO2_28) ; port MMC0_DAT1
MMC0_DAT2: U3.F18(MMC0_DAT2/GPMC_A21/UART4_RTSN/TIMER6/UART1_DSRN/PR1_PRU0_PRU_R30_9/PR1_PRU0_PRU_R31_9/GPIO2_27) ; port MMC0_DAT2
MMC0_DAT3: U3.F17(MMC0_DAT3/GPMC_A20/UART4_CTSN/TIMER5/UART1_DCDN/PR1_PRU0_PRU_R30_8/PR1_PRU0_PRU_R31_8/GPIO2_26) ; port MMC0_DAT3
MMC1_CLK: U3.U9(GPMC_CSN1/GPMC_CLK/MMC1_CLK/PRT1EDIO_DATA_IN6/PRT1_EDIO_DATA_OUT6/PR1_PRU1_PRU_R30_12/PR1_PRU1_PRU_R31_12/GPIO1_30) ; port MMC1_CLK
MMC1_CMD: U3.V9(GPMC_CSN2/GPMC_BE1N/MMC1_CMD/PR1_EDIO_DATA_IN7/PR1_EDIO_DATA_OUT7/PR1_PRU1_PRU_R30_13/PR1_PRU1_PRU_R31_13/GPIO1_31) ; port MMC1_CMD
MMC1_DAT0: U3.U7(GPMC_AD0/MMC1_DAT0//////GPIO1_0) ; port MMC1_DAT0
MMC1_DAT1: U3.V7(GPMC_AD1/MMC1_DAT1//////GPIO1_1) ; port MMC1_DAT1
MMC1_DAT2: U3.R8(GPMC_AD2/MMC1_DAT2//////GPIO1_2) ; port MMC1_DAT2
MMC1_DAT3: U3.T8(GPMC_AD3/MMC1_DAT3//////GPIO1_3) ; port MMC1_DAT3
MMC1_DAT4: U3.U8(GPMC_AD4/MMC1_DAT4//////GPIO1_4) ; port MMC1_DAT4
MMC1_DAT5: U3.V8(GPMC_AD5/MMC1_DAT5//////GPIO1_5) ; port MMC1_DAT5
MMC1_DAT6: U3.R9(GPMC_AD6/MMC1_DAT6//////GPIO1_6) ; port MMC1_DAT6
MMC1_DAT7: U3.T9(GPMC_AD7/MMC1_DAT7//////GPIO1_7) ; port MMC1_DAT7
OSC0_IN: C21.2 R13.1 U3.V10(OSC0_IN) Y2.2
OSC0_OUT: C23.2 R13.2 U3.U11(OSC0_OUT) Y2.1
OSC1_IN: C19.2 U3.A6(OSC1_IN) Y1.1
OSC1_OUT: C20.2 U3.A4(OSC1_OUT) Y1.4
PMIC_INT: U3.B18(NNMI) ; port PMIC_INT
PMIC_PGOOD: U3.B15(PORZ) ; port PMIC_PGOOD
PROC_A15: R14.1 U3.A15(EVENT_INTR0/TIMER4/CLKOUT1/SPI1_CS1/PR1PRU1R31_16/EMU2/GPIO0_19)
SYS_RESETn: C22.1 C28.1 P2.15(SRST) R12.1 S2.2(A2) S2.4 U3.A10(NRESET_INOUT) ; port SYS_RESETn
TIMER4: U3.R7(GPMC_ADVN_ALE/TIMER4/GPIO2_2) ; port TIMER4
TIMER5: U3.T6(GPMC_BE0N_CLE/TIMER5/GPIO2_5) ; port TIMER5
TIMER6: U3.U6(GPMC_WEN/TIMER6/GPIO2_4) ; port TIMER6
TIMER7: U3.T7(GPMC_OEN_REN/TIMER7/EMU4/GPIO2_3) ; port TIMER7
U5_R13: R19.1 U3.R13(GPMC_A0/GMII2_TXEN/RGMII2_TCTL/RMII2_TXEN/GPMC_A16/PR1_MII_MT1_CLK/EHRPWM1_TRIPZONE_INPUT/GPIO1_16)
U5_T13: R18.1 U3.T13(GPMC_CSN3/MMC2_CMD/PR1_MDIO_DATA/GPIO2_0)
UART4_RXD: U3.T17(GPMC_WAIT0/GM112_CRS/GPMC_CSN4/RMII2_CRS_DV/MMC1_SDCD/PR1_MII1_RXDV/UART4_RXD/GPIO0_30) ; port UART4_RXD
UART4_TXD: U3.U17(GPMC_WPN/GMII2_RXERR/GPMC_CSN5/RMII2_RXERR/MMC2_SDCD/PR1_MDIO_MDCLK/UART4_TXD/GPIO0_31) ; port UART4_TXD
USB1_OCn: U3.T16(GPMC_A10/GMII2_RXD1/RGMII2_RD1/RMII2_RXD1/GPMC_A26/PR1_MII1_CRS/MCASP0_AXR0/GPIO1_26) ; port USB1_OCn
USR0: U3.V15(GPMC_A5/GMII2_TXD0/RGMII2_TD0/RMII2_TXD0/GPMC_A21/PR1_MII1_RXD3/EQEP1B_IN/GPIO1_21) ; port USR0
USR1: U3.U15(GPMC_A6/GMII2_TXCLK/RGMII2_TCLK/MMC2_DAT4/GPMC_A22/PR1_MII1_RXD2/EQEP1_INDEX/GPIO1_22) ; port USR1
USR2: U3.T15(GPMC_A7/GMII2_RXCLK/RGMII2_RCLK/MMC2_DAT5/GPMC_A23/PR1_MII1_RXD1/EQEP1_STROBE/GPIO1_23) ; port USR2
USR3: U3.V16(GPMC_A8/GMII2_RXD3/RGMII2_RD3/MMC2_DAT6/GPMC_A24/PR1_MII1_RXD0/MCASP0_ACLKX/GPIO1_24) ; port USR3
XDMA_EVENT_INTR0: P2.17(EMU2) R14.2 U4.1(CLK)
NetR16_2: R16.2 ; port GPIO3_20
NetR17_2: R17.2 U4.5(Q)
NetR20_2: R20.2 Y3.3(CLK)
NetR22_1: R22.1 U5.4(Y)
NetU3_R14: U3.R14(GPMC_A4/GMII2_TXD1/RGMII2_TD1/RMII2_TXD1/GPMC_A20/PR1_MII1_TXD0/EQEP1A_IN/GPIO1_20) U5.2(A)

Not connected (* = marked no-connect by the designer): P2 6(NC)*; U5 1(NC)*; Y1 2* 3*

### Buses and harness runs
bus DDR_A[15..0]
bus DDR_BA[2..0]
bus DDR_D[15..0]

### Notes on the sheet
- CPU-1
- Title
- Size:
- Date:
- A3
- Number:
- Time:
- Revision:
- Sheet
- of
- File:

### Library data of the parts
C19-C21 C23 = CAP_18PF_COG_50V_5%_0402: CAP CER 18PF 50V 5% NP0 0402; Manufacturer: TDK Corporation; Manufacturer Part Number: C1005C0G1H180J050BA; Temperature Coefficient: C0G, NP0; Supplier 1: Digi-Key; Supplier Part Number 1: 445-1238-6-ND; RoHS: RoHS Compliant; Category: Capacitors; Stock 1: 352554; Pricing 1: 1=0.1, 10=0.024, 100=0.011, 250=0.009, 500=0.0077, 1000=0.006, 5000=0.005 (USD); Capacitance: 18pF; Voltage - Rated: 50V; Tolerance: ±5%; Mounting Type: Surface Mount, MLCC; Operating Temperature: -55°C ~ 125°C; Applications: General Purpose; Ratings: -; Package / Case: 0402 (1005 Metric); Size / Dimension: 0.039" L x 0.020" W (1.00mm x 0.50mm); Height - Seated (Max): -; Thickness (Max): 0.022" (0.55mm); Lead Spacing: -; Features: -; Packaging: Digi-Reel®; Lead Style: -; ComponentLink1URL: http://product.tdk.com/capacitor/mlcc/en/documents/mlcc_commercial_general_en.pdf; ComponentLink1Description: http://product.tdk.com/capacitor/mlcc/en/documents/mlcc_commercial_general_en.pdf
C22 = CAP_1.0UF_X5R_10V_10%_0402: CAP CER 1UF 10V 10% X5R 0402; Manufacturer: AVX Corporation; Manufacturer Part Number: 0402ZD105KAT2A; Capacitance: 1.0µF; Applications: General Purpose; Category: Capacitors; ComponentLink1Description: http://www.avx.com/docs/Catalogs/cx5r.pdf; ComponentLink1URL: http://www.avx.com/docs/Catalogs/cx5r.pdf; Features: -; Height - Seated (Max): -; Lead Spacing: -; Lead Style: -; Mounting Type: Surface Mount, MLCC; Operating Temperature: -55°C ~ 85°C; Package / Case: 0402 (1005 Metric); Packaging: Digi-Reel®; Pricing 1: 1=0.3, 10=0.25, 100=0.125, 250=0.09376, 500=0.08282, 1000=0.07344, 5000=0.06094 (USD); Ratings: -; RoHS: RoHS Compliant; Size / Dimension: 0.039" L x 0.020" W (1.00mm x 0.50mm); Stock 1: 409277; Supplier 1: Digi-Key; Supplier Part Number 1: 478-4596-6-ND; Temperature Coefficient: X5R; Thickness (Max): 0.022" (0.56mm); Tolerance: ±10%; Voltage - Rated: 10V
C24-C29 = CAP_0.1uF_X7R_16V_10% 0402: as C3 on sheet 02_Power; Supplier 1: Digi-Key; Supplier Part Number 1: 445-1266-6-ND; RoHS: RoHS Compliant; Category: Capacitors; Pricing 1: 1=0.1, 10=0.026, 100=0.0121, 250=0.00992, 500=0.00848, 1000=0.0066, 5000=0.0055 (USD); Voltage - Rated: 6.3V; Tolerance: ±10%; Temperature Coefficient: X5R; Mounting Type: Surface Mount, MLCC; Operating Temperature: -55°C ~ 85°C; Applications: General Purpose; Ratings: -; Package / Case: 0402 (1005 Metric); Size / Dimension: 0.039" L x 0.020" W (1.00mm x 0.50mm); Height - Seated (Max): -; Thickness (Max): 0.022" (0.55mm); Lead Spacing: -; Features: -; Packaging: Digi-Reel®; Lead Style: -
  C24-C26 C29: Stock 1: 137886; ComponentLink1URL: http://product.tdk.com/capacitor/mlcc/en/documents/mlcc_commercial_general_en.pdf; ComponentLink1Description: http://product.tdk.com/capacitor/mlcc/en/documents/mlcc_commercial_general_en.pdf
  C27: ComponentLink1Description: http://www.kemet.com/datasheets&C0402C104K4RACTU; ComponentLink1URL: http://www.kemet.com/datasheets&C0402C104K4RACTU; Stock 1: 127604
  C28: Stock 1: 127604; ComponentLink1URL: http://product.tdk.com/capacitor/mlcc/en/documents/mlcc_commercial_general_en.pdf; ComponentLink1Description: http://product.tdk.com/capacitor/mlcc/en/documents/mlcc_commercial_general_en.pdf
P2 = HDR_10x2_CJTAG: Dual Line Header 10x2pin Tin; Manufacturer: Samtec Inc; Manufacturer Part Number: FTR-110-03-G-D-06; Connector Type: Unshrouded; Number of Positions: 20; Number of Positions Loaded: 19; Pitch: 0.050" (1.27mm); Row Spacing: 0.100" (2.54mm); Supplier 1: Digi-Key; Supplier Part Number 1: FTR-110-03-G-D-06-ND; RoHS: RoHS Compliant; Category: Connectors, Interconnects; Stock 1: 0; Pricing 1: 1=4.47 (USD); Number of Rows: 2; Height Stacking (Mating): -; Molding Height Above Board: 0.100" (2.54mm); Contact Mating Length: 0.125" (3.18mm); Mounting Type: Surface Mount; Termination: Solder; Contact Finish: Gold; Contact Finish Thickness: 10µin (0.25µm); Features: -; Color: Black; Packaging: Tube; ComponentLink1URL: http://www.samtec.com/documents/webfiles/cpdf/FTR-1XX-XX-XX-D-X-XX-MKT.pdf; ComponentLink1Description: http://www.samtec.com/documents/webfiles/cpdf/FTR-1XX-XX-XX-D-X-XX-MKT.pdf
R12 = RES_10K_1/16W_1%_0402: RES 10K OHM 1/16W 5% 0402 SMD; Manufacturer: Rohm Semiconductor; Manufacturer Part Number: MCR01MZPJ103; Power (Watts): 0.063W, 1/16W; Temperature Coefficient: ±200ppm/°C; Supplier 1: Digi-Key; Supplier Part Number 1: RHM10KJDKR-ND; RoHS: RoHS Compliant; Category: Resistors; Stock 1: 110842; Pricing 1: 1=0.1, 10=0.019, 25=0.014, 100=0.0078, 250=0.00596, 500=0.00476, 1000=0.0035, 5000=0.00251 (USD); Resistance (Ohms): 10k; Composition: Thick Film; Features: Automotive AEC-Q200 Qualified; Tolerance: ±5%; Package / Case: 0402 (1005 Metric); Supplier Device Package: 0402 (1005 Metric); Size / Dimension: 0.039" L x 0.020" W (1.00mm x 0.50mm); Height: 0.016" (0.40mm); Number of Terminations: 2; Packaging: Digi-Reel®; ComponentLink1URL: http://rohmfs.rohm.com/en/products/databook/datasheet/passive/resistor/chip_resistor/mcr_a.pdf; ComponentLink1Description: http://rohmfs.rohm.com/en/products/databook/datasheet/passive/resistor/chip_resistor/mcr_a.pdf
R13 = RES_1M_1/16W_1%_0402: Resistor 1Mohm 1/16W 1% 0402; Manufacturer: Stackpole Electronics Inc; Manufacturer Part Number: RMCF0402FT1M00; Power (Watts): 0.063W, 1/16W; Temperature Coefficient: ±100ppm/°C; Supplier 1: Digi-Key; Supplier Part Number 1: RMCF0402FT1M00DKR-ND; RoHS: RoHS Compliant; Category: Resistors; Stock 1: 175650; Pricing 1: 1=0.04, 10=0.025, 50=0.0138, 100=0.0105, 250=0.0078, 500=0.00576, 1000=0.00384, 2500=0.00324, 5000=0.0027 (USD); Resistance (Ohms): 1M; Composition: Thick Film; Features: -; Tolerance: ±1%; Package / Case: 0402 (1005 Metric); Supplier Device Package: 0402; Size / Dimension: 0.039" L x 0.020" W (1.00mm x 0.50mm); Height: 0.016" (0.40mm); Number of Terminations: 2; Packaging: Digi-Reel®; ComponentLink1URL: http://www.seielect.com/Catalog/SEI-RMCF_RMCP.pdf; ComponentLink1Description: http://www.seielect.com/Catalog/SEI-RMCF_RMCP.pdf
R14 R17 R20 = RES_33_0402: RES 33 OHM 1/16W 5% 0402 SMD; Manufacturer: Panasonic Electronic Components; Manufacturer Part Number: ERJ-2GEJ330X; Resistance (Ohms): 33; Power (Watts): 0.1W, 1/10W; Temperature Coefficient: ±200ppm/°C; Supplier 1: Digi-Key; Supplier Part Number 1: P33JDKR-ND; RoHS: RoHS Compliant; Category: Resistors; Stock 1: 5879945; Pricing 1: 1=0.1, 50=0.0172, 100=0.0131, 250=0.00976, 500=0.0072, 1000=0.0048, 5000=0.00338 (USD); Composition: Thick Film; Features: -; Tolerance: ±5%; Package / Case: 0402 (1005 Metric); Supplier Device Package: 0402; Size / Dimension: 0.039" L x 0.020" W (1.00mm x 0.50mm); Height: 0.016" (0.40mm); Number of Terminations: 2; Packaging: Digi-Reel®; ComponentLink1URL: http://industrial.panasonic.com/www-cgi/jvcr13pz.cgi?E+PZ+3+AOA0001+ERJ2GEJ330X+7+WW; ComponentLink1Description: http://industrial.panasonic.com/www-cgi/jvcr13pz.cgi?E+PZ+3+AOA0001+ERJ2GEJ330X+7+WW
R15 R16 R18 R19 R22 = RES_0_1/16W_1%_0402: RES 0.0 OHM 1/16W 0402 SMD; Manufacturer: Yageo; Manufacturer Part Number: RC0402JR-070RL; Resistance (Ohms): 0.0; Power (Watts): 0.063W, 1/16W; Tolerance: Jumper; Supplier 1: Digi-Key; Supplier Part Number 1: 311-0.0JRDKR-ND; RoHS: RoHS Compliant; Category: Resistors; Stock 1: 4904429; Pricing 1: 1=0.1, 10=0.012, 25=0.0092, 100=0.0055, 250=0.00476, 500=0.00336, 1000=0.00237, 2500=0.00206, 5000=0.00178 (USD); Composition: Thick Film; Features: -; Temperature Coefficient: -; Package / Case: 0402 (1005 Metric); Supplier Device Package: 0402; Size / Dimension: 0.039" L x 0.020" W (1.00mm x 0.50mm); Height: 0.016" (0.40mm); Number of Terminations: 2; Packaging: Digi-Reel®; ComponentLink1URL: http://www.yageo.com/documents/recent/PYu-RC0402_51_RoHS_L_6.pdf; ComponentLink1Description: http://www.yageo.com/documents/recent/PYu-RC0402_51_RoHS_L_6.pdf
R21 = RES_4.7K_0402: RES 49.9 OHM 1/16W 1% 0402 SMD; Manufacturer: Yageo; Manufacturer Part Number: RC0402FR-0749R9L; Resistance (Ohms): 49.9; Power (Watts): 0.063W, 1/16W; Temperature Coefficient: ±100ppm/°C; Supplier 1: Digi-Key; Supplier Part Number 1: 311-49.9LRDKR-ND; RoHS: RoHS Compliant; Category: Resistors; Stock 1: 1338786; Pricing 1: 1=0.1, 10=0.014, 25=0.0104, 100=0.0063, 250=0.0054, 500=0.00382, 1000=0.0027, 2500=0.00234, 5000=0.00203 (USD); Composition: Thick Film; Features: -; Tolerance: ±1%; Package / Case: 0402 (1005 Metric); Supplier Device Package: 0402; Size / Dimension: 0.039" L x 0.020" W (1.00mm x 0.50mm); Height: 0.016" (0.40mm); Number of Terminations: 2; Packaging: Digi-Reel®; ComponentLink1URL: http://www.yageo.com/documents/recent/PYu-RC0402_51_RoHS_L_6.pdf; ComponentLink1Description: http://www.yageo.com/documents/recent/PYu-RC0402_51_RoHS_L_6.pdf
R23-R25 = RES_4.7K_0402: RES 4.75K 1/16W 1% 0402 SMD; Manufacturer: Stackpole Electronics Inc; Manufacturer Part Number: RMCF0402FT4K75; Power (Watts): 0.063W, 1/16W; Temperature Coefficient: ±100ppm/°C; Supplier 1: Digi-Key; Supplier Part Number 1: RMCF0402FT4K75DKR-ND; RoHS: RoHS Compliant; Category: Resistors; Stock 1: 280611; Pricing 1: 1=0.04, 10=0.025, 50=0.0138, 100=0.0105, 250=0.0078, 500=0.00576, 1000=0.00384, 2500=0.00324, 5000=0.0027 (USD); Resistance (Ohms): 4.75k; Composition: Thick Film; Features: -; Tolerance: ±1%; Package / Case: 0402 (1005 Metric); Supplier Device Package: 0402; Size / Dimension: 0.039" L x 0.020" W (1.00mm x 0.50mm); Height: 0.016" (0.40mm); Number of Terminations: 2; Packaging: Digi-Reel®; ComponentLink1URL: http://www.seielect.com/Catalog/SEI-RMCF_RMCP.pdf; ComponentLink1Description: http://www.seielect.com/Catalog/SEI-RMCF_RMCP.pdf
S2 = KMR2: as S1 on sheet 02_Power; Supplier 1: Digi-Key; Supplier Part Number 1: 401-1429-6-ND; Manufacturer Part Number: KMR231GLFS; RoHS: RoHS Compliant; Category: Switches; Stock 1: 32289; Pricing 1: 1=0.44, 10=0.416, 25=0.3744, 50=0.3326, 100=0.3188, 250=0.29108, 500=0.2772, 1000=0.22869 (USD); Mounting Type: Surface Mount; Termination Style: Gull Wing; Illumination Voltage (Nominal): -; Illumination Type, Color: -; Ingress Protection: -; Features: Grounding Pin; Packaging: Digi-Reel®; Actuator Material: -; Operating Temperature: -40°C ~ 85°C; ComponentLink1URL: http://www.ck-components.com/index.php?module=media&action=Display&cmpref=14414&lang=en&width=&height=&format=&alt=; ComponentLink1Description: http://www.ck-components.com/index.php?module=media&action=Display&cmpref=14414&lang=en&width=&height=&format=&alt=
U3 = IC_AM335X_ZCE_1: SubArctic Cortex A8 Processor 15x15; Manufacturer: Texas Instruments; Manufacturer Part Number: XAM3359ZCZ; Processor Type: ARM Microprocessor; Voltage: 1.06 V ~ 1.15 V; Supplier 1: Digi-Key; Supplier Part Number 1: 296-35073-ND; RoHS: RoHS Compliant; Category: Integrated Circuits (ICs); Stock 1: 16; Pricing 1: 1=33.5, 10=30.988, 100=26.465, 250=24.28752, 500=23.115, 1000=21.775, 2500=21.105, 5000=20.6025, 10000=20.1 (USD); Features: -; Speed: -; Mounting Type: Surface Mount; Package / Case: 324-LFBGA; Supplier Device Package: 324-NFBGA(15x15); Packaging: Tray; ComponentLink1URL: http://www.ti.com/lit/ds/symlink/am3354.pdf; ComponentLink1Description: http://www.ti.com/lit/ds/symlink/am3354.pdf
U4 = SN74LVC1G74DCTR: SINGLE  POSITIVE-EDGE-TRIGGERED  D-TYPE  FLIP-FLOP WITH  CLEAR  AND  PRESET; Manufacturer: Texas Instruments; Function: Set(Preset) and Reset; Output Type: Differential; Number of Elements: 1; Frequency - Clock: 200MHz; Delay Time - Propagation: 1.6ns; Trigger Type: Positive Edge; Current - Output High, Low: 32mA, 32mA; Voltage - Supply: 1.65 V ~ 5.5 V; Supplier 1: Digi-Key; Supplier Part Number 1: 296-25553-6-ND; Manufacturer Part Number: SN74LVC1G74DCTR; RoHS: RoHS Compliant; Category: Integrated Circuits (ICs); Stock 1: 131; Pricing 1: 1=0.59, 10=0.494, 25=0.4332, 100=0.3708, 250=0.3216, 500=0.2724, 1000=0.21 (USD); Type: D-Type; Number of Bits per Element: 1; Operating Temperature: -40°C ~ 125°C; Mounting Type: Surface Mount; Package / Case: 8-LSSOP (0.11", 2.80mm Width); Packaging: Digi-Reel®; ComponentLink1URL: http://media.digikey.com/pdf/Data%20Sheets/Texas%20Instruments%20PDFs/SN74LVC1G74.pdf; ComponentLink1Description: http://media.digikey.com/pdf/Data%20Sheets/Texas%20Instruments%20PDFs/SN74LVC1G74.pdf
U5 = SN74LVC1G06DCK: IC INVERTER SINGLE 1INPUT SC705; Manufacturer: Texas Instruments; Manufacturer Part Number: SN74LVC1G06DCKTG4; Logic Type: Inverter, Buffer; Number of Circuits: 1; Voltage - Supply: 1.65 V ~ 5.5 V; Current - Quiescent (Max): 10µA; Current - Output High, Low: -, 32mA; Logic Level - Low: 0.7 V ~ 0.8 V; Logic Level - High: 1.7 V ~ 2 V; Max Propagation Delay @ V, Max CL: 3ns @ 5V, 50pF; Supplier 1: Digi-Key; Supplier Part Number 1: SN74LVC1G06DCKTG4-ND; RoHS: RoHS Compliant; Category: Integrated Circuits (ICs); Stock 1: 0; Pricing 1: 1250=0.32 (USD); Number of Inputs: 1; Features: Open Drain; Operating Temperature: -40°C ~ 85°C; Mounting Type: Surface Mount; Supplier Device Package: SC-70-5; Package / Case: 6-TSSOP (5 Lead), SC-88A, SOT-353; Packaging: Tape & Reel (TR); ComponentLink1URL: http://www.ti.com/lit/ds/symlink/sn74lvc1g06.pdf; ComponentLink1Description: http://www.ti.com/lit/ds/symlink/sn74lvc1g06.pdf
Y1 = CRYS_32_768KHz_SMD32: CRYSTAL 32.768KHZ 12.5PF SMD; Manufacturer: Citizen Finetech Miyota; Manufacturer Part Number: CM200C-32.768KAZF-UT; Frequency Tolerance: ±30ppm; ESR (Equivalent Series Resistance): 50 kOhm; Operating Mode: Fundamental; Supplier 1: Digi-Key; Supplier Part Number 1: 300-8738-6-ND; RoHS: RoHS Compliant; Category: Crystals and Oscillators; Stock 1: 0; Pricing 1: 1=0.75, 10=0.65, 50=0.57, 100=0.45, 500=0.38, 1000=0.3 (USD); Type: kHz Crystal (Tuning Fork); Frequency: 32.768kHz; Frequency Stability: -; Load Capacitance: 12.5pF; Operating Temperature: -40°C ~ 85°C; Ratings: -; Mounting Type: Surface Mount; Package / Case: 4-SOJ, 5.50mm pitch; Size / Dimension: 0.311" L x 0.146" W (7.90mm x 3.70mm); Height: 0.098" (2.50mm); Packaging: Digi-Reel®; ComponentLink1URL: http://cfm.citizen.co.jp/english/product/pdf/CM200C_250C.pdf; ComponentLink1Description: http://cfm.citizen.co.jp/english/product/pdf/CM200C_250C.pdf
Y2 = CRYS_24MHz_SCC: CRYSTAL 24.000MHZ 18PF SMD; Manufacturer: TXC CORPORATION; Manufacturer Part Number: 7A-24.000MAAJ-T; Frequency Stability: ±30ppm; ESR (Equivalent Series Resistance): 50 Ohm; Operating Mode: Fundamental; Supplier 1: Digi-Key; Supplier Part Number 1: 887-1090-6-ND; RoHS: RoHS Compliant; Category: Crystals and Oscillators; Stock 1: 2524; Pricing 1: 1=0.79, 10=0.658, 50=0.59, 100=0.525, 500=0.5 (USD); Type: MHz Crystal; Frequency: 24MHz; Frequency Tolerance: ±30ppm; Load Capacitance: 18pF; Operating Temperature: -20°C ~ 70°C; Ratings: -; Mounting Type: Surface Mount; Package / Case: 2-SMD; Size / Dimension: 0.197" L x 0.126" W (5.00mm x 3.20mm); Height: 0.053" (1.35mm); Packaging: Digi-Reel®; ComponentLink1URL: http://www.txccrystal.com/images/pdf/7a.pdf; ComponentLink1Description: http://www.txccrystal.com/images/pdf/7a.pdf
Y3 = ASDMB: Manufacturer: Abracon Corporation; Manufacturer Part Number: ASDMB-24.576MHZ-LC-T; Function: Standby (Power Down); Output: CMOS; Voltage - Supply: 1.8 V ~ 3.3 V; Frequency Stability: ±50ppm; Current - Supply (Max): 16mA; Current - Supply (Disable) (Max): 15µA; Supplier 1: Digi-Key; Supplier Part Number 1: 535-11729-6-ND; RoHS: RoHS Compliant; Category: Crystals and Oscillators; Stock 1: 0; Pricing 1: 1=1.69, 10=1.463, 50=1.2826, 100=1.0125, 500=0.855 (USD); Type: MEMS (Silicon); Frequency: 24.576MHz; Operating Temperature: -40°C ~ 85°C; Ratings: -; Mounting Type: Surface Mount; Size / Dimension: 0.098" L x 0.079" W (2.50mm x 2.00mm); Height: 0.035" (0.90mm); Package / Case: 4-SMD, No Lead (DFN, LCC); Packaging: Digi-Reel®; ComponentLink1URL: http://www.abracon.com/Oscillators/ASDMB.pdf; ComponentLink1Description: http://www.abracon.com/Oscillators/ASDMB.pdf